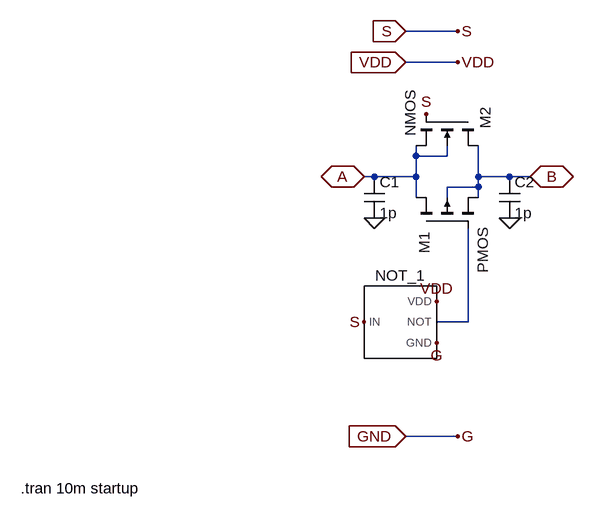
[diagram p0: schematic passgate.asc]
passgate.asc, the LTspice schematic file:
Version 4
SHEET 1 880 688
WIRE 192 -32 112 -32
WIRE 192 16 112 16
WIRE 128 160 128 144
WIRE 176 160 176 144
WIRE 176 160 128 160
WIRE 64 192 48 192
WIRE 128 192 128 160
WIRE 128 192 64 192
WIRE 224 192 224 144
WIRE 272 192 224 192
WIRE 304 192 272 192
WIRE 224 208 224 192
WIRE 224 208 176 208
WIRE 128 224 128 192
WIRE 176 224 176 208
WIRE 224 224 224 208
WIRE 208 416 208 272
WIRE 208 416 160 416
WIRE 192 592 112 592
FLAG 112 -32 S
IOPIN 112 -32 In
FLAG 192 -32 S
FLAG 144 96 S
FLAG 48 416 S
FLAG 112 16 VDD
IOPIN 112 16 In
FLAG 192 16 VDD
FLAG 160 384 VDD
FLAG 112 592 GND
IOPIN 112 592 In
FLAG 192 592 G
FLAG 160 448 G
FLAG 48 192 A
IOPIN 48 192 BiDir
FLAG 304 192 B
IOPIN 304 192 BiDir
FLAG 64 256 0
FLAG 272 256 0
SYMBOL pmos4 128 272 R270
WINDOW 0 -39 13 Left 2
WINDOW 3 -69 103 Left 2
SYMATTR InstName M1
SYMBOL nmos4 224 96 R90
WINDOW 0 -11 -11 Left 2
WINDOW 3 -38 105 Left 2
SYMATTR InstName M2
SYMBOL not 96 416 R0
SYMATTR InstName NOT_1
SYMBOL cap 48 192 R0
SYMATTR InstName C1
SYMATTR Value 1p
SYMBOL cap 256 192 R0
SYMATTR InstName C2
SYMATTR Value 1p
TEXT -480 672 Left 2 !.tran 10m startup

The netlist it stands for:
* passgate.asc
M1 A N001 B B PMOS
M2 B S A A NMOS
XNOT_1 S G N001 VDD not  ; pins IN GND NOT VDD
C1 A 0 1p
C2 B 0 1p
.model NMOS NMOS
.model PMOS PMOS
.lib standard.mos
.tran 10m startup
.backanno
.end